# Altium schematic sheet Sheet1.SchDoc
size A
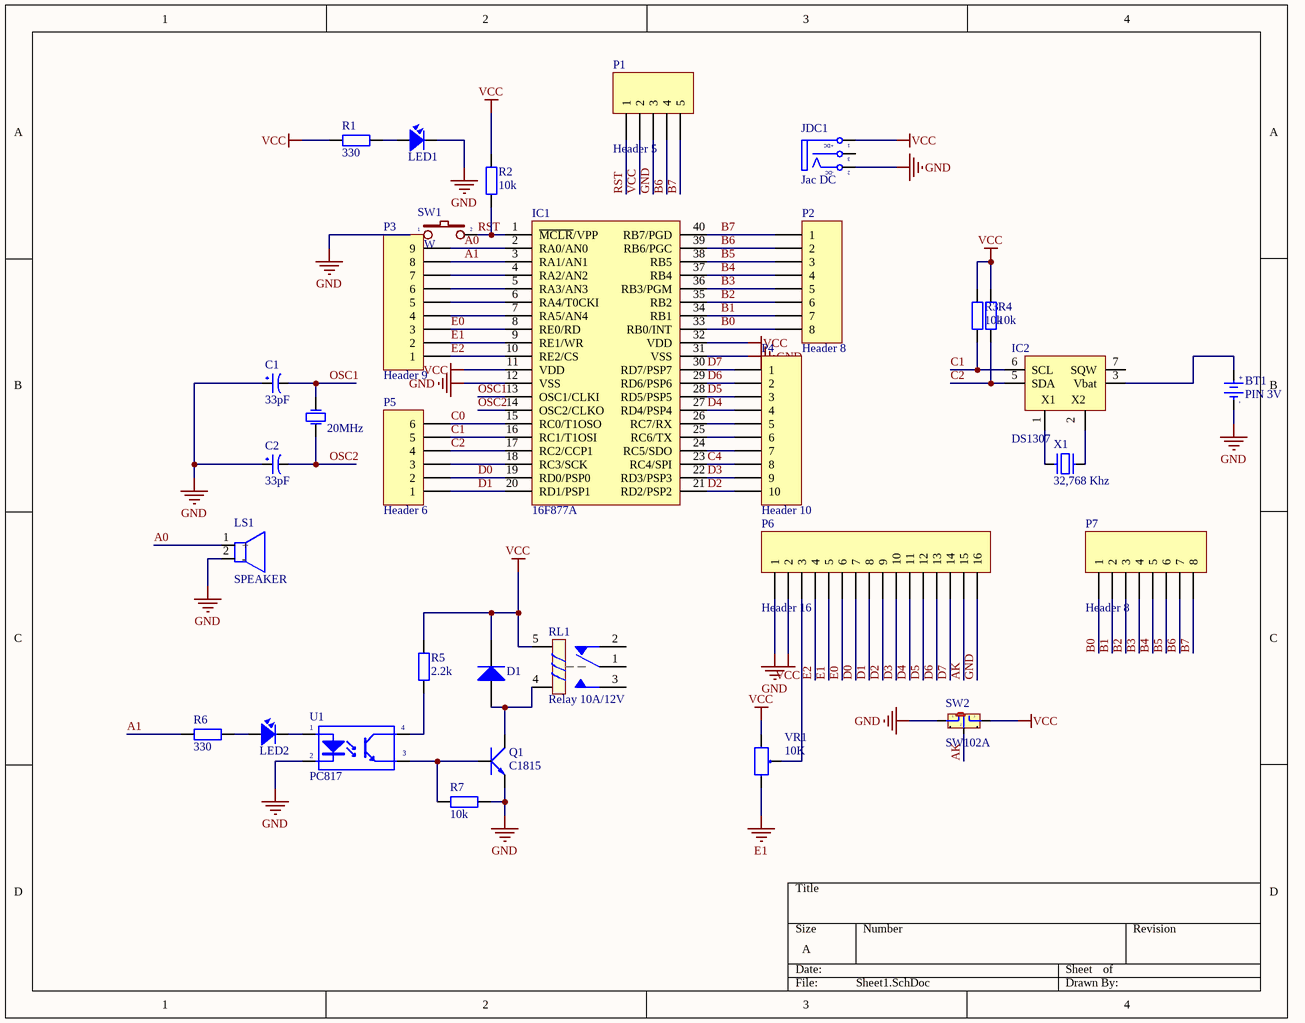
[diagram p0: Sheet1.SchDoc]

## Parts
BT1  PIN 3V  [PIN3V]
C1  33pF  [CP1/2]
C2  33pF  [CP1/2]
D1  Diode  [D5AN]  (value not drawn)
IC1  16F877A  [DIP40/W0.6]
IC2  DS1307  [DIP8/W0.3]
JDC1  Jac DC  [DC-IN]
LED1  LED  [LED-3]  (value not drawn)
LED2  LED  [LED-3]  (value not drawn)
LS1  SPEAKER  [speaker]
P1  Header 5  [Header 5]
P2  Header 8  [HDR1X8]
P3  Header 9  [Header 9]
P4  Header 10  [HDR1X10]
P5  Header 6  [Header 6]
P6  Header 16  [Header 16]
P7  Header 8  [Header 8]
Q1  C1815  [QTO-92]
R1  330  [R1/4W]
R2  10k  [R1/4W]
R3  10k  [R1/4W]
R4  10k  [R1/4W]
R5  2.2k  [R1/4W]
R6  330  [R1/4W]
R7  10k  [R1/4W]
RL1  Relay 10A/12V  [RL_SPDT_10A]
SW1  SW  [SW2]
SW2  SW102A  [SW102]
U1  PC817  [DIP4/W0.3]
VR1  10K  [VR]
X1  32,768 Khz  [XT32k]
Y1  20MHz  [XTAL]

## Nets
E1: IC1.9(RE1/WR) P3.2 P6.5 VR1.3
GND: BT1.2(GND) C1.1 C2.1 IC1.12(VSS) IC1.31(VSS) IC2.4(GND) JDC1.2(TN) LED1.2 LS1.2(-) P1.3 P6.1 P6.16 Q1.1(E) R7.2 SW1.1 SW2.1 U1.2(K)
VCC: D1.2(K) IC1.11(VDD) IC1.32(VDD) IC2.8(VCC) JDC1.1(T) P1.2 P6.2 R1.2 R2.2 R3.2 R4.2 R5.2 RL1.5 SW2.3 VR1.1
A0: IC1.2(RA0/AN0) LS1.1(+) P3.9
A1: IC1.3(RA1/AN1) P3.8 R6.1
AK: P6.15 SW2.2
B0: IC1.33(RB0/INT) P2.8 P7.1
B1: IC1.34(RB1) P2.7 P7.2
B2: IC1.35(RB2) P2.6 P7.3
B3: IC1.36(RB3/PGM) P2.5 P7.4
B4: IC1.37(RB4) P2.4 P7.5
B5: IC1.38(RB5) P2.3 P7.6
B6: IC1.39(RB6/PGC) P1.4 P2.2 P7.7
B7: IC1.40(RB7/PGD) P1.5 P2.1 P7.8
C0: IC1.15(RC0/T1OSO) P5.6
C1: IC1.16(RC1/T1OSI) IC2.6(SCL) P5.5 R3.1
C2: IC1.17(RC2/CCP1) IC2.5(SDA) P5.4 R4.1
C4: IC1.23(RC4/SPI) P4.8
D0: IC1.19(RD0/PSP0) P5.2 P6.7
D1: IC1.20(RD1/PSP1) P5.1 P6.8
D2: IC1.21(RD2/PSP2) P4.10 P6.9
D3: IC1.22(RD3/PSP3) P4.9 P6.10
D4: IC1.27(RD4/PSP4) P4.4 P6.11
D5: IC1.28(RD5/PSP5) P4.3 P6.12
D6: IC1.29(RD6/PSP6) P4.2 P6.13
D7: IC1.30(RD7/PSP7) P4.1 P6.14
E0: IC1.8(RE0/RD) P3.3 P6.6
E2: IC1.10(RE2/CS) P3.1 P6.4
OSC1: C1.2 IC1.13(OSC1/CLKI) Y1.2(OSC2)
OSC2: C2.2 IC1.14(OSC2/CLKO) Y1.1(OSC1)
RST: IC1.1(~{MCLR}/VPP) P1.1 R2.1 SW1.2
NetBT1_1: BT1.1(+3V) IC2.3(Vbat)
NetD1_1: D1.1(A) Q1.2(C) RL1.4
NetIC1_4: IC1.4(RA2/AN2) P3.7
NetIC1_5: IC1.5(RA3/AN3) P3.6
NetIC1_6: IC1.6(RA4/T0CKI) P3.5
NetIC1_7: IC1.7(RA5/AN4) P3.4
NetIC1_18: IC1.18(RC3/SCK) P5.3
NetIC1_24: IC1.24(RC5/SDO) P4.7
NetIC1_25: IC1.25(RC6/TX) P4.6
NetIC1_26: IC1.26(RC7/RX) P4.5
NetIC2_1: IC2.1(X1) X1.2
NetIC2_2: IC2.2(X2) X1.1
NetLED1_1: LED1.1 R1.1
NetLED2_1: LED2.1 R6.2
NetLED2_2: LED2.2 U1.1(A)
NetP6_3: P6.3 VR1.2
NetQ1_3: Q1.3(B) R7.1 U1.3(E)
NetR5_1: R5.1 U1.4(C)

Not connected (* = marked no-connect by the designer): IC2 7(SQW); JDC1 3(S); RL1 1 2 3; SW2 4 5

## Notes on the sheet
- (in symbol DCIN) +DC; -DC
- (in symbol PIN 3V) +; -

## Library data of the parts
BT1 = PIN 3V: Battery 3VDC; Value: PIN 3V
C1 C2 = CP1: Cap P  0,1uF < 22uF , 16 - 50V; Value: 10uF/50V; Description 1: 10 => 220uF/6,3V/10V - 10uF => 100uF/16V; Description 2: 0,1uF => 33uF/50V - 10uF => 22uF/63V; Description 3: 0,47uF => 10uF/100V
D1 = Diode: Default Diode; Code - JEDEC: DO-214-AB; Value: 1N5007; Published: 8-Jun-2000; Revision: July-2002: Re-released for DXP Platform.; Publisher: Altium Limited
IC1 = 16F877: 8K FLASH, 368B RAM, 256B EFROM; Value: PIC16F877A; Value: DIP 40; Copyright by: VanDungEvn
IC2 = DS1307: Real Timer Serial; Value: DS1307
JDC1 = DCIN: Jac DC input; Value: Jac DC
LED1 LED2 = LED: LED Single colour Green and Red; Value: LED 3 ly Single Colour
LS1 = SPEAKER: Vendor: Digikey; Published: 13-April-2009; Publisher: Hoang Nguyen; ComponentLink1Description: Digikey Part Link; ComponentLink2Description: Open Datasheet; ComponentLink2URL: H:\LIBRARY\LIBRARY.Datasheet\
P1 = Header 5: Header, 5-Pin; LatestRevisionDate: 17-Jul-2002; LatestRevisionNote: Re-released for DXP Platform.; Publisher: Altium Limited
P2 P7 = Header 8: Header, 8-Pin; LatestRevisionDate: 17-Jul-2002; LatestRevisionNote: Re-released for DXP Platform.; Publisher: Altium Limited
P3 = Header 9: Header, 9-Pin; LatestRevisionDate: 17-Jul-2002; LatestRevisionNote: Re-released for DXP Platform.; Publisher: Altium Limited
P4 = Header 10: Header, 10-Pin; LatestRevisionDate: 17-Jul-2002; LatestRevisionNote: Re-released for DXP Platform.; Publisher: Altium Limited
P5 = Header 6: Header, 6-Pin; LatestRevisionDate: 17-Jul-2002; LatestRevisionNote: Re-released for DXP Platform.; Publisher: Altium Limited
P6 = Header 16: Header, 16-Pin; LatestRevisionDate: 17-Jul-2002; LatestRevisionNote: Re-released for DXP Platform.; Publisher: Altium Limited
Q1 = C1815: NPN 600mW, ECB; Value: C1815
R1-R7 = R1/4W: Resistor 1/4W; Value: R1/4W - 1K
RL1 = Relay 1: Relay SPDT,10A - 12VDC 5 Pin; Value: Relay SPDT, 10A, 12V
SW1 = SW2: Switch button 2 pin; Value: SW chip 2 pin
SW2 = SW102A: Switch 102 on Broad; Value: Switch 102 On Board
U1 = PC817: Single Opto; Value: PC817
VR1 = VR: Var Resistor; Value: VR 10K
X1 = XT32k: Crystal 32,768kHz for timer real; Value: 32,768khz
Y1 = XTAL_1: Crystal Oscillator; Published: 8-Jun-2000; LatestRevisionDate: 17-Jul-2002; LatestRevisionNote: Re-released for DXP Platform.; PackageReference: R38; Publisher: Altium Limited